# Altium schematic sheet Flyback Supply.SchDoc
size A
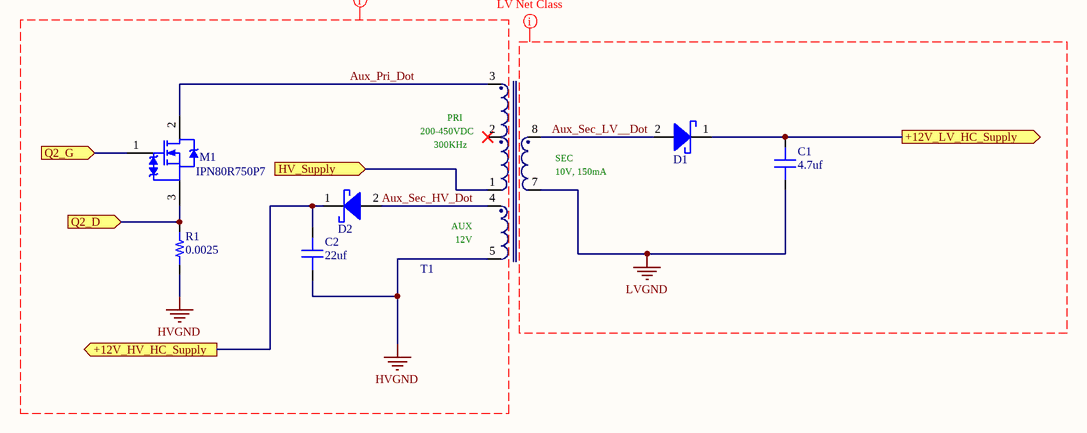
[diagram p0: Flyback Supply.SchDoc]

## Parts
C1  value 4.7uf  [CAP 0805/2012]  (hidden comment: Capacitor MLCC 4.7uf 25V CAP 0805/2012)
C2  value 22uf  [CAP 1206/3216 - 1.8MM]  (hidden comment: Capacitor MLCC 22uf 25V CAP 1206/3216)
D1  BAT46WJ  [SOD323F]  (value not drawn)
D2  BAT46WJ  [SOD323F]  (value not drawn)
M1  AUX Transistor  [PG-SOT223]  (value not drawn)
R1  value 0.0025  [RES 0603/1608]  (hidden comment: RES 0.0025 OHM 1% 1/4W 0603)
T1  Aux Transformer  [750817020]  (value not drawn)

## Ports
+12V_HV_HC_Supply (out), +12V_LV_HC_Supply (out), HV_Supply (in), Q2_D (in), Q2_G (in)

## Nets
HVGND: C2.1 R1.1 T1.5
LVGND: C1.1 T1.7
+12V_HV_HC_Supply: C2.2 D2.1(K) ; port +12V_HV_HC_Supply
+12V_LV_HC_Supply: C1.2 D1.1(K) ; port +12V_LV_HC_Supply
Aux_Pri_Dot: M1.2(D) T1.3
Aux_Sec_HV_Dot: D2.2(A) T1.4
Aux_Sec_LV__Dot: D1.2(A) T1.8
HV_Supply: T1.1 ; port HV_Supply
Q2_D: M1.3(S) R1.2 ; port Q2_D
Q2_G: M1.1(G) ; port Q2_G

Not connected (* = marked no-connect by the designer): T1 2*

## Layout directives
net class LV: Aux_Sec_LV__Dot, LVGND
net class HV: Aux_Pri_Dot, Aux_Sec_HV_Dot, HVGND

## Notes on the sheet
- (in symbol 1) PRI; 300KHz; SEC; 10V, 150mA; AUX; 12V

## Library data of the parts
C1 = 713: Manufacturer_id: 1; idCapacitor: 713; Name: Cap_4.7uf_25V_CAP 0805/2012; Dielectric: Ceramic; Created_By: Nick Mah; Drawer_id: 1; Voltage_Rating: 25V; Package: CAP 0805/2012; Created_Date: 10/20/2018
C2 = 1092: Manufacturer_id: 1; idCapacitor: 1092; Name: Cap_22uf_25V_CAP 1206/3216; Dielectric: Ceramic; Created_By: Nick Mah; Drawer_id: 1; Voltage_Rating: 25V; Package: CAP 1206/3216; ComponentLink1Description: Datasheet
D1 D2 = 16: Diode Schottky 100V 250mA (DC) Surface Mount SOD-323F; Manufacturer_id: 1; MfrPartNo: BAT46WJ,115; idDiode: 16; Value: Vf=0.3@20mA; Power: 100Vr; Created_By: Nick Mah; Drawer_id: 1; Name: BAT46WJ; Type: Schottky; Num_Circuits: 1; Ic: 250mA; Package: SOD-323F; Link: https://www.digikey.com/product-detail/en/nexperia-usa-inc/BAT46WJ115/1727-4817-1-ND/2531304; ComponentLink1Description: Datasheet; ComponentLink1URL: https://assets.nexperia.com/documents/data-sheet/BAT46WJ.pdf; Supplier1: Digi-Key; Supplier1PartNo: 1727-4817-1-ND
M1 = 14: COOLMOS P7 800V SOT-223; MfrPartNo: IPN80R750P7ATMA1; Manufacturer_id: 1; idFETs: 14; Value: N_Channel; Id: 7A; Rds_On: 750mOhm; Vgs(typ): 10V; Vgs(Max): 20V; Power(Max): 7.2W; Created_By: Nick Mah; Drawer_id: 1; Name: IPN80R750P7; Vdss: 800V; Num_Circuits: 1; Package: PG-SOT223; Link: https://www.digikey.com/product-detail/en/infineon-technologies/IPN80R750P7ATMA1/IPN80R750P7ATMA1TR-ND/8130852; ComponentLink1Description: Datasheet; ComponentLink1URL: https://www.infineon.com/dgdl/Infineon-IPN80R750P7-DS-v02_00-EN.pdf?fileId=5546d4625f2e26bc015f528bca636b84; Supplier1: Digi-Key; Supplier1PartNo: IPN80R750P7ATMA1TR-ND
R1 = 2711: 2.5 mOhms ±1% 0.25W, 1/4W Chip Resistor 0603 (1608 Metric) Automotive AEC-Q200, Current Sense, Moisture Resistant Metal Foil; Manufacturer_id: 1; idResistor: 2711; Name: CSRF0603FT2L50; Created_By: Nick Mah; Supplier 1: Digi-Key; Supplier Part Number 1: CSRF0603FT2L50CT-ND; Drawer_id: 1; Tolerance: 1%; Power: 1/4W; Package: 0603; MfrPartNo: CSRF0603FT2L50; Link: https://www.digikey.com/product-detail/en/stackpole-electronics-inc/CSRF0603FT2L50/CSRF0603FT2L50CT-ND/5798089; ComponentLink1Description: Datasheet; ComponentLink1URL: https://www.seielect.com/catalog/sei-csrf.pdf
T1 = 1: Auxilliary Transformer for DC-DC Senior Project; idTransformer: 1; Name: 500W DC-DC Aux Trfrmr; Value: 4mH - 9.33:1:1.17; Current_Rating: 100mA; Tolerance: 10%; Voltage_Primary: 200-450VDC; Voltage_Secondary: 10VDC; Manufacturer_id: 1; Drawer_id: 1; Package: Through Hole; MfrPartNo: 750817020; Link: https://katalog.we-online.com/en/ctm/MID-OLLT/S/750817020?m=n&sq=750817020&sp=https%3A%2F%2Fwww.we-online.com%2Fweb%2Fen%2Fwuerth_elektronik%2Fsearchpage.php%3Fsearch%3D750817020#vs_ct:1; ComponentLink1Description: Datasheet; ComponentLink1URL: https://katalog.we-online.com/ctm/datasheet/750817020.pdf